# Altium schematic sheet RECOVERY_USB.SchDoc
size B; SheetNumber: 6; SheetTotal: 25
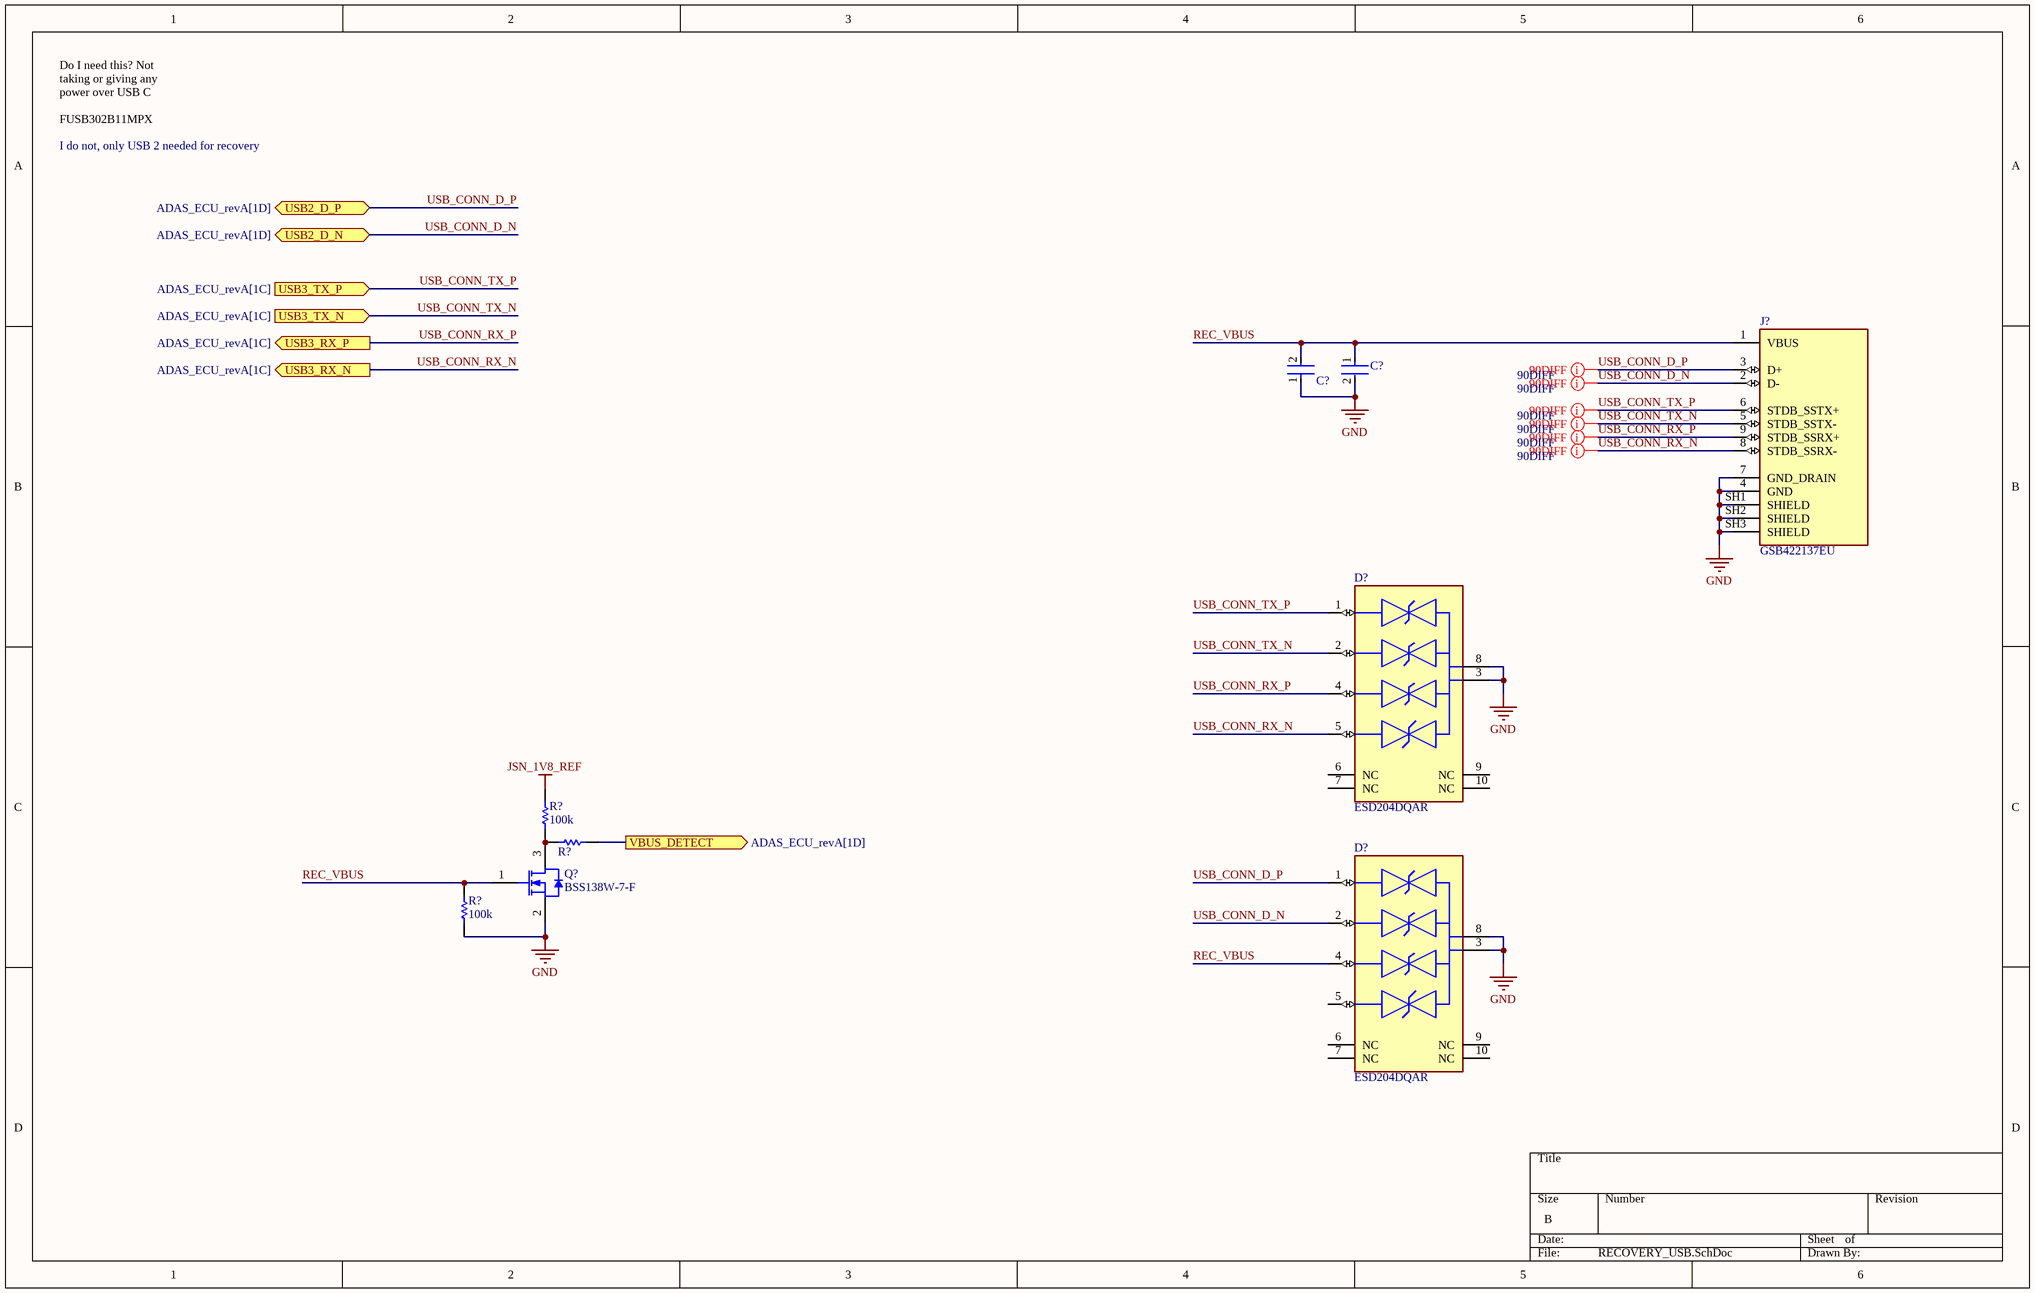
[diagram p0: RECOVERY_USB.SchDoc]

## Parts
(Parts that share a designator on the sheet are numbered #1, #2 ... from top to bottom, then left to right.)
C?#1  GRM188R60J106ME47D  [FP-GRM188-0_1-e0_2_0_55-IPC_A]  (value not drawn)
C?#2  C1005X7R1H104K050BB  [FP-C1005-050-0_05-IPC_C]  (value not drawn)
D?#1  ESD204DQAR  [FP-DQA0010A-MFG]
D?#2  ESD204DQAR  [FP-DQA0010A-MFG]
J?  GSB422137EU  [GSB422137EU-Footprint-1]
Q?  BSS138W-7-F  [DIOD-SOT323-3_V]
R?#1  100k  [R0603B]
R?#2  0402 JUMPER  [RESC1005X40X25ML05T05]  (value not drawn)
R?#3  100k  [R0603B]

## Ports
USB2_D_N (bidir, see ADAS_ECU_revA[1D]), USB2_D_P (bidir, see ADAS_ECU_revA[1D]), USB3_RX_N (out, see ADAS_ECU_revA[1C]), USB3_RX_P (out, see ADAS_ECU_revA[1C]), USB3_TX_N (in, see ADAS_ECU_revA[1C]), USB3_TX_P (in, see ADAS_ECU_revA[1C]), VBUS_DETECT (out, see ADAS_ECU_revA[1D])

## Nets
GND: C?#1.2 C?#2.1 D?#1.3(GND) D?#1.8(GND) D?#2.3(GND) D?#2.8(GND) J?.4(GND) J?.7(GND_DRAIN) J?.SH1(SHIELD) J?.SH2(SHIELD) J?.SH3(SHIELD) Q?.2(S) R?#3.1
JSN_1V8_REF: R?#1.2
REC_VBUS: C?#1.1 C?#2.2 D?#2.4(IO3) J?.1(VBUS) Q?.1(G) R?#3.2
USB_CONN_D_N: D?#2.2(IO2) J?.2(D-) ; port USB2_D_N
USB_CONN_D_P: D?#2.1(IO1) J?.3(D+) ; port USB2_D_P
USB_CONN_RX_N: D?#1.5(IO4) J?.8(STDB_SSRX-) ; port USB3_RX_N
USB_CONN_RX_P: D?#1.4(IO3) J?.9(STDB_SSRX+) ; port USB3_RX_P
USB_CONN_TX_N: D?#1.2(IO2) J?.5(STDB_SSTX-) ; port USB3_TX_N
USB_CONN_TX_P: D?#1.1(IO1) J?.6(STDB_SSTX+) ; port USB3_TX_P
VBUS_DETECT: R?#2.2 ; port VBUS_DETECT
NetQ?_3: Q?.3(D) R?#1.1 R?#2.1

Not connected (* = marked no-connect by the designer): D?#1 6(NC) 7(NC) 9(NC) 10(NC); D?#2 5(IO4) 6(NC) 7(NC) 9(NC) 10(NC)

## Layout directives
differential pair; differential pair class 90DIFF: USB_CONN_D_N, USB_CONN_D_P, USB_CONN_RX_N, USB_CONN_RX_P, USB_CONN_TX_N, USB_CONN_TX_P

## Notes on the sheet
- Do I need this? Not taking or giving any power over USB C
  FUSB302B11MPX
- I do not, only USB 2 needed for recovery

## Library data of the parts
C?#1 = CMP-2006-02792-2: Chip Multilayer Ceramic Capacitors for General Purpose, 0603, 10uF, X5R, 15%, 20%, 6.3V; Packaging: Tape and Reel; Voltage Rating (DC): 6.3V; Width: 0.031inch; Termination: SMD/SMT; Dielectric: X5R; Package Quantity: 4000; Voltage Rating: 6.3V; Capacitance: 10uF; Case/Package: 0603; Min Operating Temperature: -55°C; Voltage: 6.3V; Length: 1.6mm; Thickness: 0.035inch; Lead Free: Lead Free; Depth: 0.8mm; Case Code (Imperial): 0603; Max Operating Temperature: 85°C; Material: Ceramic; Height: 0.8mm; Tolerance: 20%; Mount: Surface Mount; REACH SVHC: No SVHC; Radiation Hardening: No; Case Code (Metric): 1608
C?#2 = CMP-2000-05393-2: Multilayer Ceramic Capacitors 100nF ±10% 50V X7R SMD 0402; Voltage: 50V; Dielectric Material: Ceramic; Min Operating Temperature: -55°C; Depth: 0.5mm; Radiation Hardening: No; RoHS Compliant: Yes; Voltage Rating (DC): 50V; Lead Free: Lead Free; Resistor Type: Ceramic; Height: 0.5mm; Dielectric: X7R; Thickness: 0.022inch; Case/Package: 0402; Case Code (Metric): 1005; Termination: SMD/SMT; Capacitance: 100nF; Packaging: Tape and Reel; Max Operating Temperature: 125°C; Mount: Surface Mount; Package Quantity: 1; Width: 0.02inch; Weight: 2.3E-05oz; Voltage Rating: 50V; Tolerance: 10%; Construction: Flat; Case Code (Imperial): 0402; Length: 1mm; REACH SVHC: No SVHC; Series: C
D?#1 D?#2 = CMP-04989-000002-1: 4-CHANNEL LOW-CAPACITANCE SURGE; Manufacturer: Texas Instruments; Value: 0.55pF; Reverse Standoff Voltage: 3.6V; Standoff Height: 0mm; Breakdown Voltage: 5.5V; Peak Pulse Current: 5.5A; Clamping Voltage: 11.5V; Direction: Bidirectional; Peak Pulse Power: 50W; Number Of Channels: 4; Ambient Temperature Range High: +125°C; ComponentLink2Description: Datasheet; Height: 0.55mm; Lead Free: Yes; Device Class L3: unset; Temperature Range High: +125°C; Temperature Range Low: -40°C; Package: DQA0010A; Temperature: -40°C to +125°C; Capacitance: 0.55pF; RoHS: TRUE; Mouser Description: 4-Channel Low-Capacitance Surge and ESD Protection Diode 10-USON -40 to 125; Category: Diode; Device Class L1: Circuit Protection; Octopart: https://octopart.com/esd204dqar-texas+instruments-89917476; Device Class L2: TVS Diodes; Ambient Temperature Range Low: -40°C; Manufacturer Part Number: ESD204DQAR; ComponentLink2URL: http://www.ti.com/lit/ds/symlink/esd204.pdf; Automotive: No; Digikey Description: 4-CHANNEL LOW-CAPACITANCE SURGE
J? = CMP-002-00094-1: USB Connector, USB Type B, USB 3.1, Receptacle, 9 Ways, Through Hole Mount, Vertical; Gender: Receptacle; Pins: 9; Connector Type: USB; Mounting Technology: Through Hole, Vertical
Q? = CMP-2000-05968-1: N-Channel Enhancement Mode Mosfet, 50 V, 200 mA, -55 to 150 degC, 6-Pin SOT-323, RoHS, Tape and Reel; Typical Turn-Off Delay Time: 20ns; Number of Channels: 1Channel; Type: EnhancementModeFieldEffectTransistor; Brand: DiodesIncorporated; Vds - Drain-Source Breakdown Voltage: 75V; Vgs - Gate-Source Voltage: 20V; Rds On - Drain-Source Resistance: 1.4Ohms; Transistor Type: 1N-Channel; Configuration: Single; Unit Weight: 0.000212oz; Pd - Power Dissipation: 200mW; Id - Continuous Drain Current: 200mA; Forward Transconductance - Min: 0.1S; Manufacturer URL: http://www.diodes.com/; Series: BSS138; Package Description: 3-Pin Small Outline Transistor, Body 2 x 1.25 mm, Pitch 0.65 mm; Mounting Technology: SurfaceMount; Product Category: MOSFET; RoHS: True; Maximum Operating Temperature: +150C; Height: 1mm; Length: 2.2mm; Technology: Si; Width: 1.35mm; Datasheet URL: http://www.diodes.com/_files/datasheets/ds30206.pdf; Manufacturer: DiodesIncorporated; Package / Case: SOT-323-3; Typical Turn-On Delay Time: 20ns; Transistor Polarity: N-Channel; Factory Pack Quantity: 3000; Packaging: Reel; Product: MOSFETSmallSignal; Datasheet Version: Rev. 11-2, 09/2013; Package Reference: SOT323; Minimum Operating Temperature: -55C; Mounting Style: SMD/SMT; Channel Mode: Enhancement
R?#1 R?#3 = CMP-009-00002-14: Resistor
R?#2 = CMP-009-00118-2: READ THE NAME; Pins: 2; Component Type: Standard; Design Item ID: CMP-009-00206-2; Source: 0402jump.SchLib